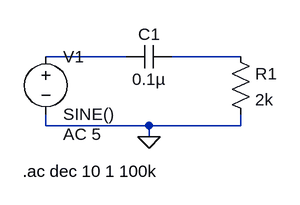
[diagram p0: schematic High Pass RC Filter.asc]
High Pass RC Filter.asc, the LTspice schematic file:
Version 4
SHEET 1 880 680
WIRE 128 112 16 112
WIRE 288 112 192 112
WIRE 16 208 16 192
WIRE 160 208 16 208
WIRE 288 208 288 192
WIRE 288 208 160 208
WIRE 160 224 160 208
FLAG 160 224 0
SYMBOL voltage 16 96 R0
WINDOW 123 24 124 Left 2
WINDOW 39 0 0 Left 0
SYMATTR Value2 AC 5
SYMATTR InstName V1
SYMATTR Value SINE()
SYMBOL res 272 96 R0
SYMATTR InstName R1
SYMATTR Value 2k
SYMBOL cap 192 96 R90
WINDOW 0 0 32 VBottom 2
WINDOW 3 32 32 VTop 2
SYMATTR InstName C1
SYMATTR Value 0.1µ
TEXT -16 272 Left 2 !.ac dec 10 1 100k

The netlist it stands for:
* High Pass RC Filter.asc
V1 N001 0 SINE() AC 5
R1 N002 0 2k
C1 N002 N001 0.1µ
.ac dec 10 1 100k
.backanno
.end